# Altium schematic sheet display.SchDoc
size A4; SheetNumber: 3; SheetTotal: 4
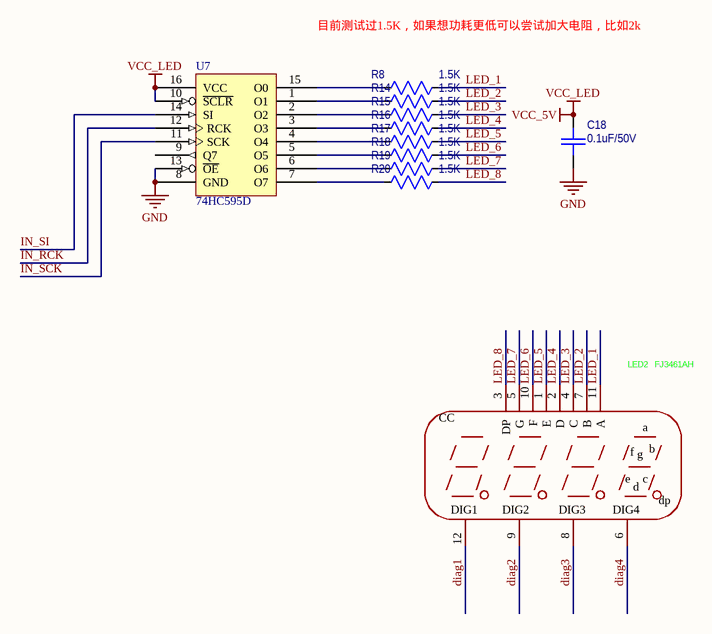
[diagram p0: display.SchDoc]

## Parts
C18  0.1uF/50V  [CAPC1608X092N_0603]
LED2  FJ3461AH  [LED-SEG-TH_12P-L30.0-W14.0-P2.54-S10.26-BL]
R8  1.5K  [RESC1608X055N_0603]
R14  1.5K  [RESC1608X055N_0603]
R15  1.5K  [RESC1608X055N_0603]
R16  1.5K  [RESC1608X055N_0603]
R17  1.5K  [RESC1608X055N_0603]
R18  1.5K  [RESC1608X055N_0603]
R19  1.5K  [RESC1608X055N_0603]
R20  1.5K  [RESC1608X055N_0603]
U7  74HC595D  [SOIC-16_L9.9-W3.9-P1.27-LS6.0-BL]

## Nets
GND: C18.2 U7.8(GND) U7.13(~{OE})
VCC_5V: C18.1 U7.10(~{SCLR}) U7.16(VCC)  [also labelled VCC_LED]
diag1: LED2.12(DIG1)
diag2: LED2.9(DIG2)
diag3: LED2.8(DIG3)
diag4: LED2.6(DIG4)
IN_RCK: U7.12(RCK)
IN_SCK: U7.11(SCK)
IN_SI: U7.14(SI)
LED_1: LED2.11(A) R8.1
LED_2: LED2.7(B) R14.1
LED_3: LED2.4(C) R15.1
LED_4: LED2.2(D) R16.1
LED_5: LED2.1(E) R17.1
LED_6: LED2.10(F) R18.1
LED_7: LED2.5(G) R19.1
LED_8: LED2.3(DP) R20.1
NetR8_2: R8.2 U7.15(O0)
NetR14_2: R14.2 U7.1(O1)
NetR15_2: R15.2 U7.2(O2)
NetR16_2: R16.2 U7.3(O3)
NetR17_2: R17.2 U7.4(O4)
NetR18_2: R18.2 U7.5(O5)
NetR19_2: R19.2 U7.6(O6)
NetR20_2: R20.2 U7.7(O7)

Not connected (* = marked no-connect by the designer): U7 9(Q7)

## Notes on the sheet
- 目前测试过1.5K，如果想功耗更低可以尝试加大电阻，比如2k
- (in symbol FJ5461AH 红色) CC; a; f; b; g; e; c; d; dp

## Library data of the parts
C18 = Capacitor_0603: Capacitor, MLCC; Manufacturer: KEMET; PartNumber: C0603C104M5RACTU; Tolerance: [tol]; TempCo: [tempco]; Voltage Rating: [voltage]; ComponentLink1URL: *; Current Rating: *; ComponentLink1Description: Datasheet; Power Rating: *; Package: 0603; Value: 0.1uF/50V; SupplierDescription: CAP CER 0.1UF 50V X7R 0603
LED2 = FJ5461AH 红色: Manufacturer: 志浩; Symbol: FJ5461AH red; Add into BOM: yes; Number of Characters: 4位; Display Type: 7段; Luminous Color: 红色; LED Polarity: 共阴极; Digit/Alpha Size(inch): 0.56; Device: FJ5461AH 红色; LCSC Part Name: 4位0.56英寸红色数码管 共阴极; Supplier Part: C54396; Manufacturer Part: FJ5461AH 红色; Supplier Footprint: 插件; JLCPCB Part Class: Extended Part; Datasheet: https://atta.szlcsc.com/upload/public/pdf/source/20151111/1457707576636.pdf; Supplier: LCSC; Convert to PCB: yes; Module Size: -; Power Dissipation: -; Value: FJ3461AH
R8 R14-R20 = Resistor_0603: Resistor, Standard; Manufacturer: Yageo; PartNumber: RC0603FR-1075KL; Power Rating: [power]; TempCo: [tempco]; Tolerance: tol; ComponentLink1URL: *; ComponentLink1Description: Datasheet; Package: 0603; Value: 1.5K; SupplierDescription: RES SMD 75K OHM 1% 1/10W 0603
U7 = 74HC595: Value: 74HC595D